# Altium project Modelo levitador magnético.PrjPcb
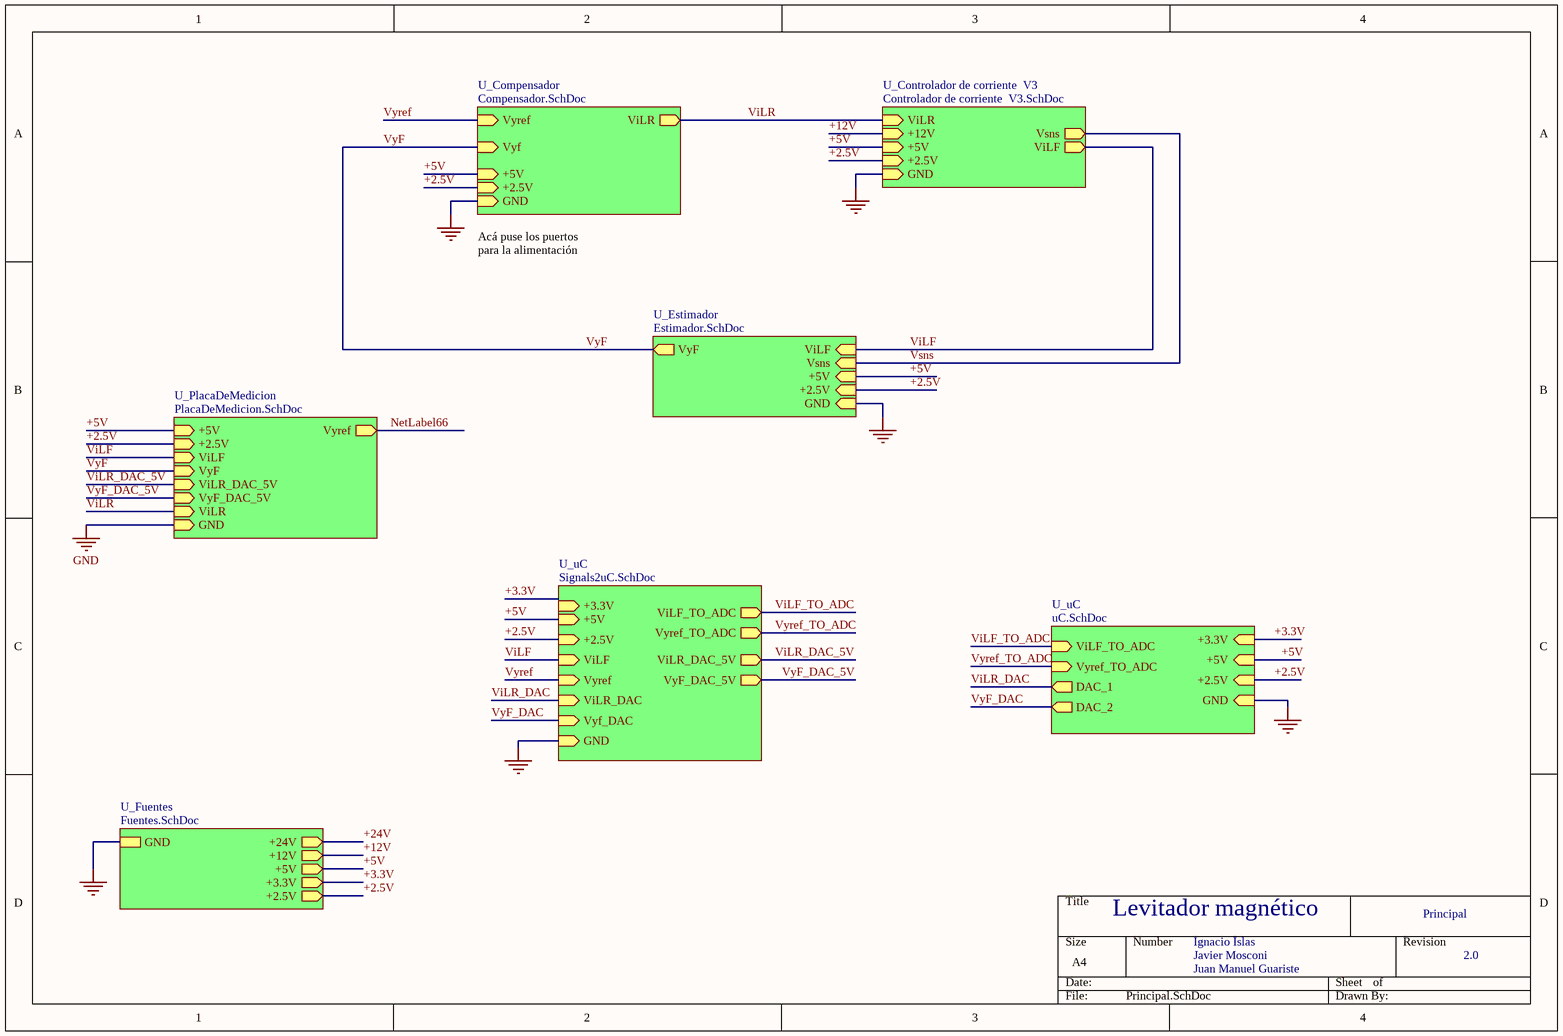
[diagram p0: Principal.SchDoc]
8 sheets, 222 parts. Net scope: hierarchical (ports join the sheet entries above them; power ports are global).
Sheets:
  Principal.SchDoc
    U_Controlador de corriente  V3 = Controlador de corriente  V3.SchDoc
    U_Fuentes = Fuentes.SchDoc
    U_Compensador = Compensador.SchDoc
    U_Estimador = Estimador.SchDoc
    U_uC = Signals2uC.SchDoc
    U_uC = uC.SchDoc
    U_PlacaDeMedicion = PlacaDeMedicion.SchDoc

## Sheet Principal.SchDoc: Levitador magnético
size A4; Date: 27/10/2020

### Sub-sheets
U_Compensador = Compensador.SchDoc: Vyf (in), ViLR (out), Vyref (in), +5V (in), +2.5V (in), GND (in)
U_Controlador de corriente  V3 = Controlador de corriente  V3.SchDoc: ViLR (in), ViLF (out), Vsns (out), +2.5V (in), +5V (in), GND (in), +12V (in)
U_Estimador = Estimador.SchDoc: ViLF (in), Vsns (in), +5V (in), +2.5V (in), GND (in), VyF (out)
U_Fuentes = Fuentes.SchDoc: +12V (out), +5V (out), +2.5V (out), +24V (out), GND, +3.3V (out)
U_PlacaDeMedicion = PlacaDeMedicion.SchDoc: Vyref (out), +5V (in), +2.5V (in), ViLF (in), VyF (in), ViLR_DAC_5V (in), VyF_DAC_5V (in), GND (in), ViLR (in)
U_uC = Signals2uC.SchDoc: ViLF (in), +3.3V (in), +5V (in), +2.5V (in), GND (in), Vyref (in), ViLF_TO_ADC (out), Vyref_TO_ADC (out), ViLR_DAC (in), Vyf_DAC (in), ViLR_DAC_5V (out), VyF_DAC_5V (out)
U_uC = uC.SchDoc: +3.3V (in), +5V (in), +2.5V (in), GND (in), ViLF_TO_ADC (in), Vyref_TO_ADC (in), DAC_1 (out), DAC_2 (out)

### Nets
+2.5V: sheet U_Controlador de corriente  V3/+2.5V, sheet U_Fuentes/+2.5V, sheet U_Compensador/+2.5V, sheet U_Estimador/+2.5V, sheet U_uC/+2.5V, sheet U_uC/+2.5V, sheet U_PlacaDeMedicion/+2.5V
+3.3V: sheet U_Fuentes/+3.3V, sheet U_uC/+3.3V, sheet U_uC/+3.3V
+5V: sheet U_Controlador de corriente  V3/+5V, sheet U_Fuentes/+5V, sheet U_Compensador/+5V, sheet U_Estimador/+5V, sheet U_uC/+5V, sheet U_uC/+5V, sheet U_PlacaDeMedicion/+5V
+12V: sheet U_Controlador de corriente  V3/+12V, sheet U_Fuentes/+12V
GND: sheet U_Controlador de corriente  V3/GND, sheet U_Fuentes/GND, sheet U_Compensador/GND, sheet U_Estimador/GND, sheet U_uC/GND, sheet U_uC/GND, sheet U_PlacaDeMedicion/GND  [project net VSSA]
ViLF: sheet U_Controlador de corriente  V3/ViLF, sheet U_Estimador/ViLF, sheet U_uC/ViLF, sheet U_PlacaDeMedicion/ViLF
ViLF_TO_ADC: sheet U_uC/ViLF_TO_ADC, sheet U_uC/ViLF_TO_ADC
ViLR: sheet U_Controlador de corriente  V3/ViLR, sheet U_Compensador/ViLR, sheet U_PlacaDeMedicion/ViLR
ViLR_DAC: sheet U_uC/ViLR_DAC, sheet U_uC/DAC_1
ViLR_DAC_5V: sheet U_uC/ViLR_DAC_5V, sheet U_PlacaDeMedicion/ViLR_DAC_5V
Vsns: sheet U_Controlador de corriente  V3/Vsns, sheet U_Estimador/Vsns
VyF: sheet U_Compensador/Vyf, sheet U_Estimador/VyF, sheet U_PlacaDeMedicion/VyF
VyF_DAC: sheet U_uC/Vyf_DAC, sheet U_uC/DAC_2
VyF_DAC_5V: sheet U_uC/VyF_DAC_5V, sheet U_PlacaDeMedicion/VyF_DAC_5V
Vyref: sheet U_Compensador/Vyref, sheet U_uC/Vyref
Vyref_TO_ADC: sheet U_uC/Vyref_TO_ADC, sheet U_uC/Vyref_TO_ADC

### Notes on the sheet
- Acá puse los puertos para la alimentación
- Principal
- Ignacio Islas
- Javier Mosconi
- Juan Manuel Guariste
- 2.0

## Sheet Controlador de corriente  V3.SchDoc: Levitador magnético
size A4
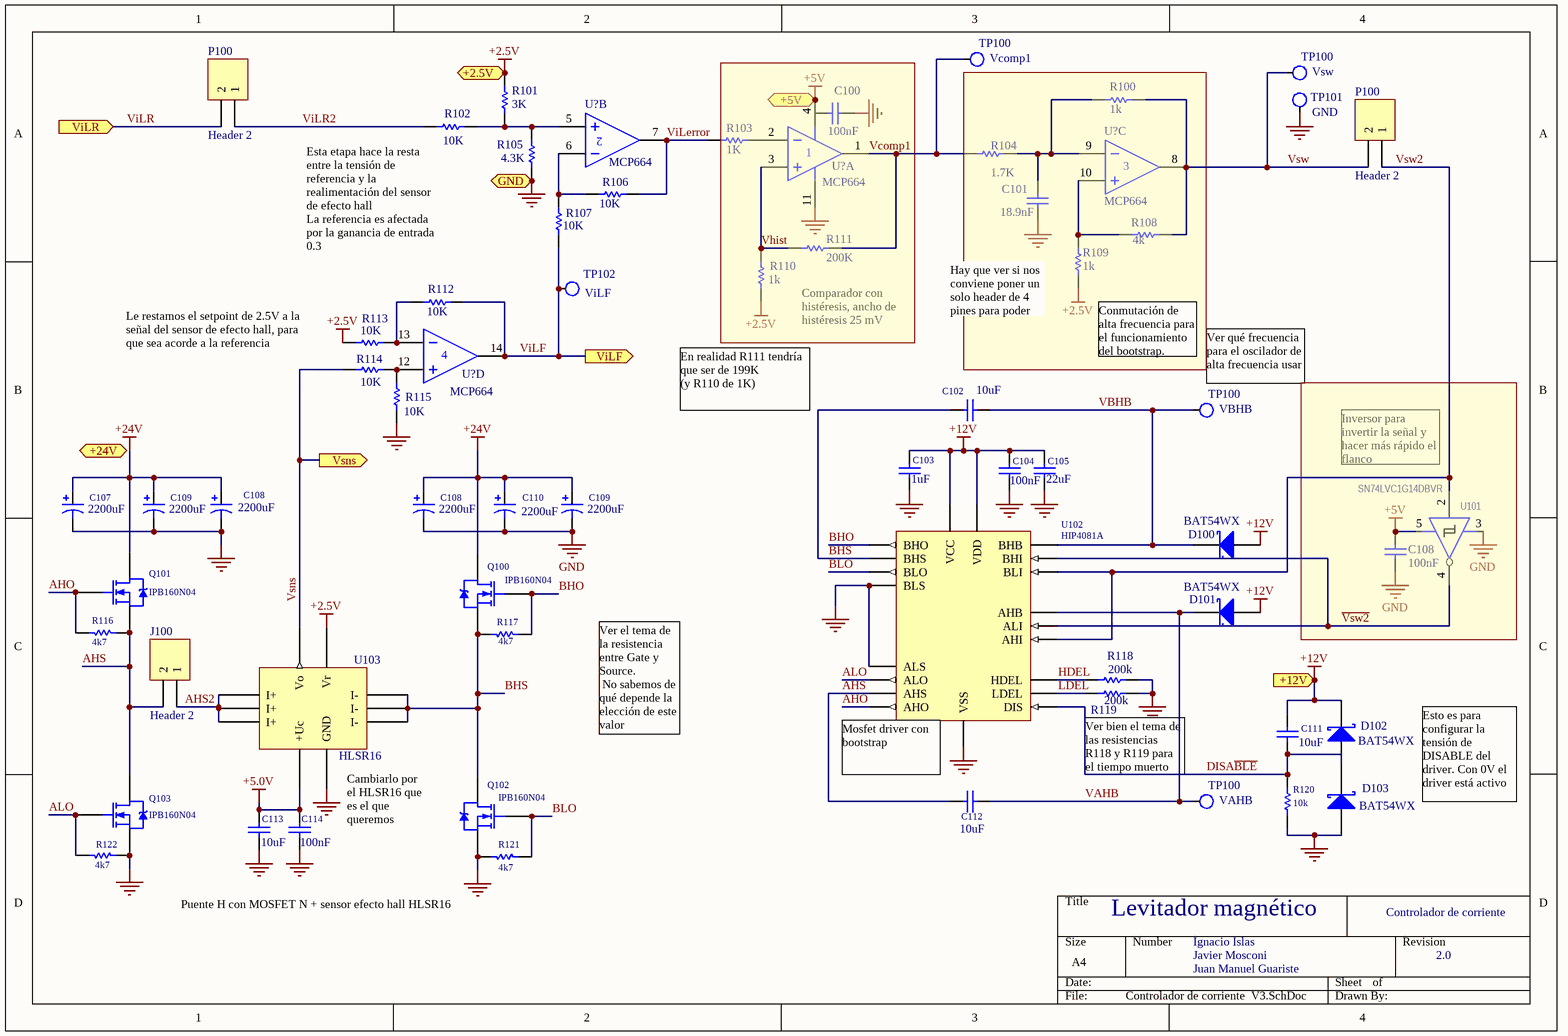
[diagram p1: Controlador de corriente  V3.SchDoc]

### Parts
(Parts that share a designator on the sheet are numbered #1, #2 ... from top to bottom, then left to right.)
C100  value 100nF  [C1206]  (hidden comment: Cap)
C101  value 18.9nF  [C1206]  (hidden comment: Cap)
C102  10uF  [C1206]
C103  1uF  [C1206]
C104  100nF  [C1206]
C105  22uF  [C1206]
C107  value 2200uF  [ALU CASE P]  (hidden comment: Cap Pol1)
C108#1  value 2200uF  [ALU CASE P]  (hidden comment: Cap Pol1)
C108#2  value 2200uF  [ALU CASE P]  (hidden comment: Cap Pol1)
C108#3  value 100nF  [C1206]  (hidden comment: Cap)
C109#1  value 2200uF  [ALU CASE P]  (hidden comment: Cap Pol1)
C109#2  value 2200uF  [ALU CASE P]  (hidden comment: Cap Pol1)
C110  value 2200uF  [ALU CASE P]  (hidden comment: Cap Pol1)
C111  10uF  [C1206]
C112  10uF  [C1206]
C113  10uF  [C1206]
C114  100nF  [C1206]
D100  BAT54WX  [SOD523]
D101  BAT54WX  [SOD523]
D102  BAT54WX  [SOD523]
D103  BAT54WX  [SOD523]
J100  Header 2  [SMKDS5-2-9.5]
P100#1  Header 2  [HDR1X2]
P100#2  Header 2  [HDR1X2]
Q100  IPB160N04  [TO263-7S]
Q101  IPB160N04  [TO263-7S]
Q102  IPB160N04  [TO263-7S]
Q103  IPB160N04  [TO263-7S]
R100  value 1k  [R 1206L]  (hidden comment: Res1)
R101  value 3K  [R 1206L]  (hidden comment: Res1)
R102  value 10K  [R 1206L]  (hidden comment: Res1)
R103  value 1K  [R 1206L]  (hidden comment: Res1)
R104  value 1.7K  [R 1206L]  (hidden comment: Res1)
R105  value 4.3K  [R 1206L]  (hidden comment: Res1)
R106  value 10K  [R 1206L]  (hidden comment: Res1)
R107  value 10K  [R 1206L]  (hidden comment: Res1)
R108  value 4k  [R 1206L]  (hidden comment: Res1)
R109  value 1k  [R 1206L]  (hidden comment: Res1)
R110  value 1k  [R 1206L]  (hidden comment: Res1)
R111  value 200K  [R 1206L]  (hidden comment: Res1)
R112  value 10K  [R 1206L]  (hidden comment: Res1)
R113  value 10K  [R 1206L]  (hidden comment: Res1)
R114  value 10K  [R 1206L]  (hidden comment: Res1)
R115  value 10K  [R 1206L]  (hidden comment: Res1)
R116  4k7  [R 1206L]
R117  4k7  [R 1206L]
R118  value 200k  [R 1206L]  (hidden comment: Res1)
R119  value 200k  [R 1206L]  (hidden comment: Res1)
R120  10k  [R 1206L]
R121  4k7  [R 1206L]
R122  4k7  [R 1206L]
TP100#1  Vcomp1  [TestPoint Keystone 5000 Silver-Red]
TP100#2  Vsw  [TestPoint Keystone 5000 Silver-Red]
TP100#3  VBHB  [TestPoint Keystone 5000 Silver-Red]
TP100#4  VAHB  [TestPoint Keystone 5000 Silver-Red]
TP101  GND  [TestPoint Keystone 5000 Silver-Red]
TP102  ViLF  [TestPoint Keystone 5000 Silver-Red]
U101  SN74LVC1G14DBVR  [SOT23-5]
U102  HIP4081A  [SOIC20]
U103  HLSR16  [HSLR-P]
U?#1  MCP664  (part B of 4)
U?#2  MCP664  (part A of 4)
U?#3  MCP664  (part C of 4)
U?#4  MCP664  (part D of 4)

### Ports
+2.5V (in), +5V (in), +12V (in), +24V (in), GND (in), ViLF (out), ViLR (in), Vsns (out)

### Nets
+2.5V: R101.2 R109.1 R110.1 R113.1 U103.1(Vr) ; port +2.5V
+5V: C108#3.1 C113.2 C114.2 U101.5(V+) U103.4(+Uc) U?#2.4(V+) ; port +5V  [also labelled +5.0V]
+12V: C103.2 C104.2 C105.2 C111.1 D100.1(A) D101.1(A) D102.2(K) U102.15(VCC) U102.16(VDD) ; port +12V
+24V: C107.1 C108#1.1 C108#2.1 C109#1.1 C109#2.1 C110.1 Q100.4(D) Q101.4(D)
GND: C100.2 C101.1 C103.1 C104.1 C105.1 C107.2 C108#1.2 C108#2.2 C108#3.2 C109#1.2 C109#2.2 C110.2 C113.1 C114.1 D103.1(A) Q102.2(S) Q102.3(S) Q102.5(S) Q102.6(S) Q102.7(S) Q103.2(S) Q103.3(S) Q103.5(S) Q103.6(S) Q103.7(S) R105.2 R115.1 R118.2 R119.2 R120.2 R121.2 R122.1 TP101.1 U101.3(V-) U102.4(VSS) U102.14(ALS) U102.17(BLS) U103.3(GND) U?#2.11(V-) ; port GND  [project net VSSA]
AHO: Q101.1(G) R116.2 U102.11(AHO)
AHS: C112.1 J100.2 Q101.2(S) Q101.3(S) Q101.5(S) Q101.6(S) Q101.7(S) Q103.4(D) R116.1 U102.12(AHS)
AHS2: J100.1 U103.8(I+) U103.9(I+) U103.10(I+)
ALO: Q103.1(G) R122.2 U102.13(ALO)
BHO: Q100.1(G) R117.1 U102.20(BHO)
BHS: C102.2 Q100.2(S) Q100.3(S) Q100.5(S) Q100.6(S) Q100.7(S) Q102.4(D) R117.2 U102.19(BHS) U103.5(I-) U103.6(I-) U103.7(I-)
BLO: Q102.1(G) R121.1 U102.18(BLO)
DISA~{BLE}: C111.2 R120.1 U102.3(DIS)
HDEL: R118.1 U102.8(HDEL)
LDEL: R119.1 U102.9(LDEL)
~{Vsw2}: U101.4(Y) U102.2(BHI) U102.6(ALI)
VAHB: C112.2 D101.2(K) TP100#4.1 U102.10(AHB)
VBHB: C102.1 D100.2(K) TP100#3.1 U102.1(BHB)
Vcomp1: R104.1 R111.2 TP100#1.1 U?#2.1(OUT)
Vhist: R110.2 R111.1 U?#2.3(IN+)
ViLerror: R103.1 R106.2 U?#1.7(OUT)
ViLF: R107.1 R112.2 TP102.1 U?#4.14(OUT) ; port ViLF
ViLR: P100#1.2 ; port ViLR
ViLR2: P100#1.1 R102.1
Vsns: R114.1 U103.2(Vo) ; port Vsns
Vsw: P100#2.2 R100.2 R108.2 TP100#2.1 U?#3.8(OUT)
Vsw2: P100#2.1 U101.2(A) U102.5(BLI) U102.7(AHI)
NetC101_2: C101.2 R100.1 R104.2 U?#3.9(IN-)
NetD102_1: D102.1(A) D103.2(K)
NetR101_1: R101.1 R102.2 R105.1 U?#1.5(IN+)
NetR103_2: R103.2 U?#2.2(IN-)
NetR106_1: R106.1 R107.2 U?#1.6(IN-)
NetR108_1: R108.1 R109.2 U?#3.10(IN+)
NetR112_1: R112.1 R113.2 U?#4.13(IN-)
NetR114_2: R114.2 R115.2 U?#4.12(IN+)

Not connected (* = marked no-connect by the designer): C100 1

### Notes on the sheet
- (near R102) Esta etapa hace la resta entre la tensión de referencia y la realimentación del sensor de efecto hall
  La referencia es afectada por la ganancia de entrada 0.3
- Hay que ver si nos conviene poner un solo header de 4 pines para poder puentear el oscilador de alta frecuencia
- Le restamos el setpoint de 2.5V a la señal del sensor de efecto hall, para que sea acorde a la referencia
- Comparador con histéresis, ancho de histéresis 25 mV
- Conmutación de alta frecuencia para el funcionamiento del bootstrap.
  Frecuencia a determinar >= 20 kHz (ponele)
- (near TP100#3) Ver qué frecuencia para el oscilador de alta frecuencia usar
- En realidad R111 tendría que ser de 199K
  (y R110 de 1K)
- Inversor para invertir la señal y hacer más rápido el flanco
- Ver el tema de la resistencia entre Gate y Source.
  No sabemos de qué depende la elección de este valor
- (near U102) Mosfet driver con bootstrap
- Ver bien el tema de las resistencias R118 y R119 para el tiempo muerto
- Esto es para configurar la tensión de DISABLE del driver. Con 0V el driver está activo
- Puente H con MOSFET N + sensor efecto hall HLSR16
- (near U103) Cambiarlo por el HLSR16 que es el que queremos
- Controlador de corriente
- Ignacio Islas
- Javier Mosconi
- Juan Manuel Guariste
- 2.0

### Library data of the parts
C100 C101 C108#3 = Cap: Capacitor; Published: 8-Jun-2000; LatestRevisionDate: 17-Jul-2002; LatestRevisionNote: Re-released for DXP Platform.; PackageReference: RAD-0.3; Publisher: Altium Limited; PackageDescription: Radial Cap, Thru-Hole; 2 Leads; 0.3 in Pin Spacing
C102-C105 C111-C114 = C1206: Capacitor Chip 1206; Dielectric: NP0; Voltage: 50V; Published: 8-Jun-2000; LatestRevisionDate: 26/08/2013; LatestRevisionNote: IPC-7351 Footprint Added.; PackageReference: 1206; Publisher: Altium Limited; PackageDescription: Chip Capacitor; Supplier 1: Digi-Key
  C102 C111-C113: Value: 10uF
  C103: Value: 1uF
  C104 C114: Value: 100nF
  C105: Value: 22uF
C107 C108#1 C108#2 C109#1 C109#2 C110 = Cap Pol1: Polarized Capacitor (Radial); ESR: 0.028 ohm; Published: 8-Jun-2000; LatestRevisionDate: 17-Jul-2002; LatestRevisionNote: Re-released for DXP Platform.; PackageReference: RB7.6-15; Publisher: Altium Limited
D100-D103 = Diode 10TQ035: Schottky Rectifier; Note: Terminal 2 is the TAB and is electrically connected to the cathode; Published: 8-Jun-2000; LatestRevisionDate: 17-Jul-2002; LatestRevisionNote: Re-released for DXP Platform.; DatasheetDocument: PD-2.057B; PackageDocument: Feb-1998; PackageReference: TO-220AC; Publisher: Altium Limited; ComponentLink1Description: Manufacturer Link; ComponentLink1URL: http://www.irf.com/; ComponentLink2Description: Datasheet; ComponentLink2URL: http://www.irf.com/product-info/datasheets/data/10tq.pdf
J100 P100#1 P100#2 = Header 2: Header, 2-Pin; LatestRevisionDate: 17-Jul-2002; LatestRevisionNote: Re-released for DXP Platform.; Publisher: Altium Limited
Q100-Q103 = IRF630S: HEXFET N-Channel Power MOSFET; Published: 8-Jun-2000; LatestRevisionDate: 17-Jul-2002; LatestRevisionNote: Re-released for DXP Platform.; DatasheetVersion: PD-9.901; PackageReference: PG-TO263-7-3; Publisher: Altium Limited; PackageDescription: D2-PAK/TO-263-AB; 3 Leads (1 Cropped); Body 15.5 (inc. leads) x 10.5 mm (LxW max); ComponentLink1Description: Manufacturer Link; ComponentLink1URL: http://www.irf.com/; ComponentLink2Description: Datasheet; ComponentLink2URL: http://www.irf.com/product-info/datasheets/data/irf630s.pdf
R100-R115 R118 R119 = Res1: Resistor; Published: 8-Jun-2000; LatestRevisionDate: 17-Jul-2002; LatestRevisionNote: Re-released for DXP Platform.; PackageReference: AXIAL-0.3; Publisher: Altium Limited; PackageDescription: Axial Device, Thru-Hole; 2 Leads; 0.3 in Pin Spacing
R116 R117 R120-R122 = R1206: Resistor Chip; 1/8W;; Published: 8-Jun-2000; LatestRevisionDate: 26/8/2013; PackageReference: 1206; Publisher: Altium Limited; PackageDescription: SMT Chip Resistor; Supplier 1: Digi-Key
  R116 R117 R121 R122: Value: 4k7
  R120: Value: 10k
TP100#1-TP100#4 TP101 TP102 = Tespoint: Test point
U101 = SN74LVC1G14DBVR: Schmitt-Trigger Inverter; Published: 8-Jun-2000; LatestRevisionDate: 13-Apr-2006; LatestRevisionNote: IPC-7351 Footprint Added.; DatasheetVersion: Jul-1998; PackageVersion: Jan-1998; PackageReference: D014; Publisher: Altium Limited; PackageDescription: 14-Pin Small Outline Integrated Circuit 1.27 mm Pitch; Code_IPC: SOIC127P600-14; ComponentLink1Description: Manufacturer Link; ComponentLink1URL: http://www.ti.com/; ComponentLink2Description: Datasheet; ComponentLink2URL: http://www-s.ti.com/sc/ds/sn74ahc14.pdf; ComponentLink3Description: Packaging Specification; ComponentLink3URL: http://focus.ti.com/lit/ml/mpds177/mpds177.pdf
U102 = HIP4081A: INTERSIL, 80V, 2.5A peak, High Frequency Full Bridge FET Driver
U103 = HSLR32: Hall Effect Current Sensor
U?#1-U?#4 = MCP664: Datasheet: https://ar.mouser.com/datasheet/2/268/22194B-77503.pdf

## Sheet Fuentes.SchDoc
size A4
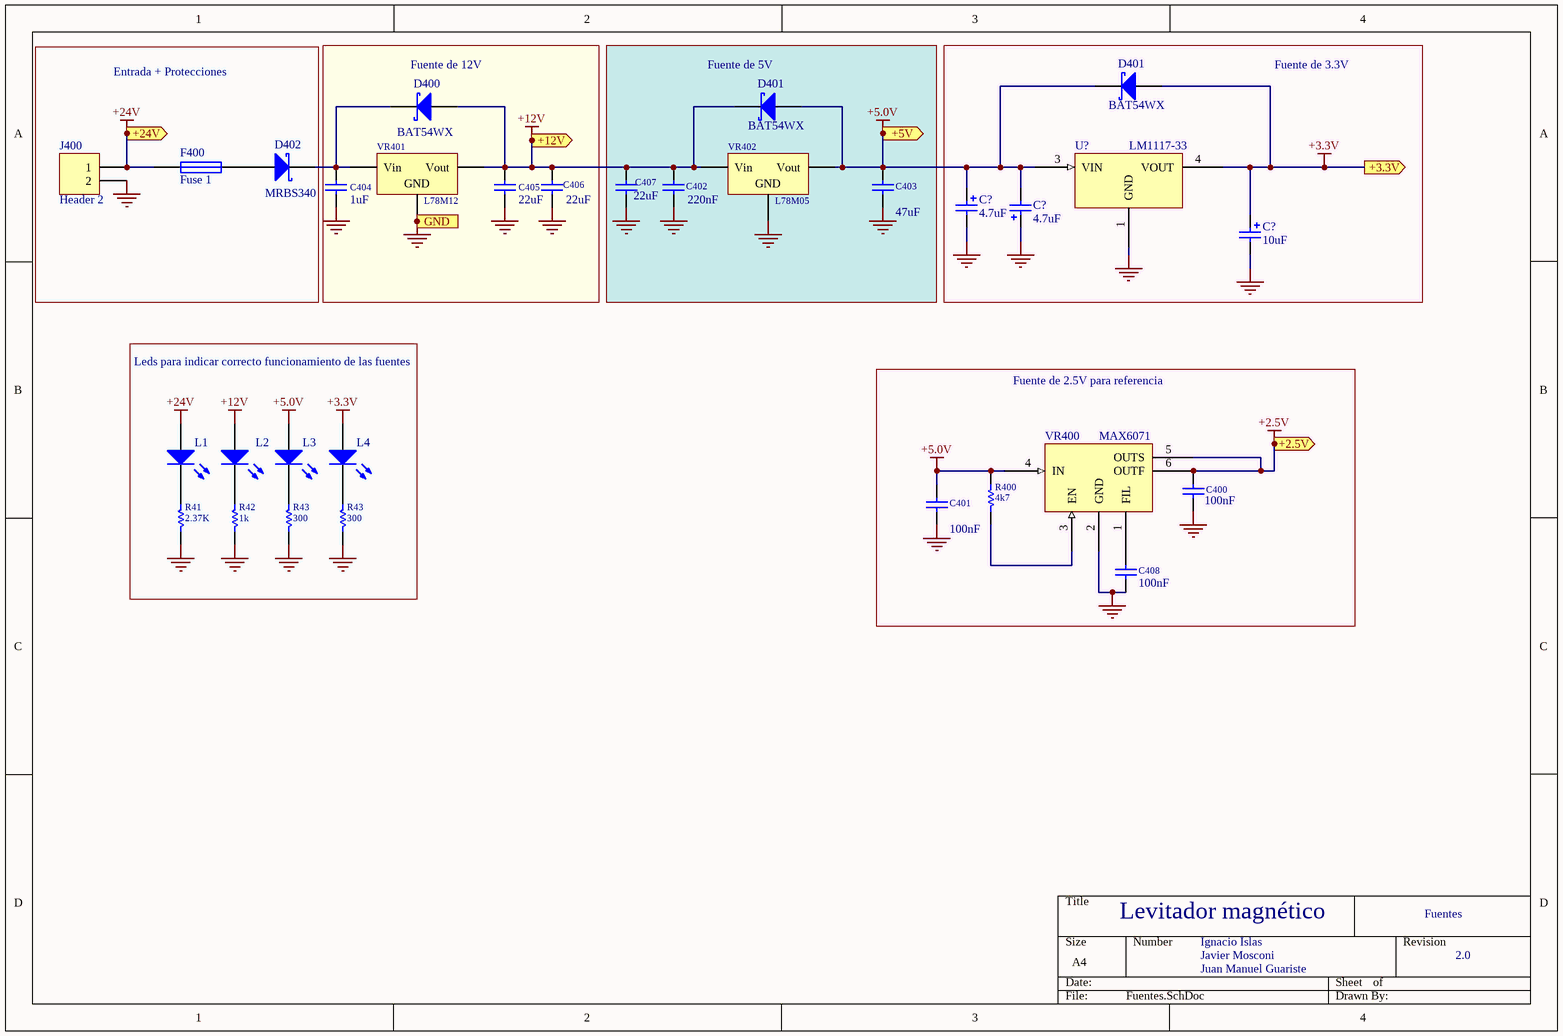
[diagram p2: Fuentes.SchDoc]

### Parts
(Parts that share a designator on the sheet are numbered #1, #2 ... from top to bottom, then left to right.)
C400  100nF  [C1206]
C401  100nF  [C1206]
C402  220nF  [C1206]
C403  47uF  [C1206]
C404  1uF  [C1206]
C405  22uF  [C1206]
C406  22uF  [C1206]
C407  22uF  [C1206]
C408  100nF  [C1206]
C?#1  value 4.7uF  [0805C2]  (hidden comment: Cap Pol2)
C?#2  value 4.7uF  [0805C2]  (hidden comment: Cap Pol2)
C?#3  value 10uF  [0805C2]  (hidden comment: Cap Pol2)
D400  BAT54WX  [SOD523]
D401#1  BAT54WX  [SOD523]
D401#2  BAT54WX  [SOD523]
D402  MRBS340  [DO214AB]
F400  Fuse 1  [R1206]
J400  Header 2  [SMKDS5-2-9.5]
L1  LED1  [LED 1206 RED]  (value not drawn)
L2  LED1  [LED 1206 RED]  (value not drawn)
L3  LED1  [LED 1206 RED]  (value not drawn)
L4  LED1  [LED 1206 RED]  (value not drawn)
R41  2.37K  [R 1206L]
R42  1k  [R 1206L]
R43#1  300  [R 1206L]
R43#2  300  [R 1206L]
R400  4k7  [R 1206L]
U?#5  LM1117-33  [SOT223-4M]
VR400  MAX6071  [SOT23-6]
VR401  L78M12  [TO252-AA]
VR402  L78M05  [TO252-AA]

### Blocks framed on the sheet
Entrada + Protecciones: D402 F400 J400
Fuente de 12V: C404-C406 D400 VR401
Fuente de 5V: C402 C403 C407 D401#2 VR402
Fuente de 3.3V: C?#1-C?#3 D401#1 U?#5
Leds para indicar correcto funcionamiento de las fuentes: L1-L4 R41 R42 R43#1 R43#2
Fuente de 2.5V para referencia: C400 C401 C408 R400 VR400

### Ports
+2.5V (out), +3.3V (out), +5V (out), +12V (out), +24V (out), GND

### Nets
+2.5V: C400.2 VR400.5(OUTS) VR400.6(OUTF) ; port +2.5V
+3.3V: C?#3.1 D401#1.1(A) L4.1(A) U?#5.4(VOUT) ; port +3.3V
+5.0V: C401.2 C403.2 C?#1.1 C?#2.2 D401#1.2(K) D401#2.1(A) L3.1(A) R400.2 U?#5.3(VIN) VR400.4(IN) VR402.3(Vout) ; port +5V  [project net +5V]
+12V: C402.2 C405.2 C406.2 C407.2 D400.1(A) D401#2.2(K) L2.1(A) VR401.3(Vout) VR402.1(Vin) ; port +12V
+24V: F400.1 J400.1 L1.1(A) ; port +24V
GND: C400.1 C401.1 C402.1 C403.1 C404.1 C405.1 C406.1 C407.1 C408.1 C?#1.2 C?#2.1 C?#3.2 J400.2 R41.1 R42.2 R43#1.1 R43#2.1 U?#5.1(GND) VR400.2(GND) VR401.4(GND) VR402.4(GND) ; port GND  [project net VSSA]
NetC404_2: C404.2 D400.2(K) D402.2(K) VR401.1(Vin)
NetC408_2: C408.2 VR400.1(FIL)
NetD402_1: D402.1(A) F400.2
NetL1_2: L1.2(K) R41.2
NetL2_2: L2.2(K) R42.1
NetL3_2: L3.2(K) R43#1.2
NetL4_2: L4.2(K) R43#2.2
NetR400_1: R400.1 VR400.3(EN)

### Notes on the sheet
- Levitador magnético
- Fuentes
- Ignacio Islas
- Javier Mosconi
- Juan Manuel Guariste
- 2.0

### Library data of the parts
C400 C401 C408 = C1206: as C102 on sheet Controlador de corriente  V3; Published: 8-Jun-2000; LatestRevisionDate: 26/08/2013; LatestRevisionNote: IPC-7351 Footprint Added.; PackageReference: 1206; Publisher: Altium Limited; PackageDescription: Chip Capacitor; Supplier 1: Digi-Key; Value: 100nF
C402 C404 = C1206: Capacitor Chip 1206; Dielectric: NP0; Voltage: 35V; Published: 8-Jun-2000; LatestRevisionDate: 26/08/2013; LatestRevisionNote: IPC-7351 Footprint Added.; PackageReference: 1206; Publisher: Altium Limited; PackageDescription: Chip Capacitor; Supplier 1: Digi-Key
  C402: Value: 220nF
  C404: Value: 1uF
C403 = C1206: Capacitor Chip 1206; Dielectric: NP0; Voltage: 6.3V; Published: 8-Jun-2000; LatestRevisionDate: 26/08/2013; LatestRevisionNote: IPC-7351 Footprint Added.; PackageReference: 1206; Publisher: Altium Limited; PackageDescription: Chip Capacitor; Supplier 1: Digi-Key; Value: 47uF
C405-C407 = C1206: Capacitor Chip 1206; Dielectric: NP0; Voltage: 16V; Published: 8-Jun-2000; LatestRevisionDate: 26/08/2013; LatestRevisionNote: IPC-7351 Footprint Added.; PackageReference: 1206; Publisher: Altium Limited; PackageDescription: Chip Capacitor; Supplier 1: Digi-Key; Value: 22uF
C?#1-C?#3 = Cap Pol2: Polarized Capacitor (Axial); P/N: Generic; Published: 8-Jun-2000; LatestRevisionDate: 17-Jul-2002; LatestRevisionNote: Re-released for DXP Platform.; PackageReference: POLAR0.8; Publisher: Altium Limited; Package: 0603
D400 D401#1 D401#2 D402 = Diode 10TQ035: as D100 on sheet Controlador de corriente  V3; Published: 8-Jun-2000; LatestRevisionDate: 17-Jul-2002; LatestRevisionNote: Re-released for DXP Platform.; DatasheetDocument: PD-2.057B; PackageDocument: Feb-1998; PackageReference: TO-220AC; Publisher: Altium Limited; ComponentLink1Description: Manufacturer Link; ComponentLink1URL: http://www.irf.com/; ComponentLink2Description: Datasheet; ComponentLink2URL: http://www.irf.com/product-info/datasheets/data/10tq.pdf
F400 = Fuse 1: Fuse; Published: 8-Jun-2000; LatestRevisionDate: 17-Jul-2002; LatestRevisionNote: Re-released for DXP Platform.; PackageReference: PIN-W2/E2.8; Publisher: Altium Limited
J400 = Header 2: Header, 2-Pin; LatestRevisionDate: 17-Jul-2002; LatestRevisionNote: Re-released for DXP Platform.; Publisher: Altium Limited
L1-L4 = LED1: Typical RED GaAs LED; Published: 8-Jun-2000; LatestRevisionDate: 08-Jul-2005; LatestRevisionNote: Mech Layer 1 removed.; PackageReference: LED-1; Publisher: Altium Limited
R41 R42 R43#1 R43#2 R400 = R1206: Resistor Chip; 1/8W;; Published: 8-Jun-2000; LatestRevisionDate: 26/8/2013; PackageReference: 1206; Publisher: Altium Limited; PackageDescription: SMT Chip Resistor; Supplier 1: Digi-Key
  R41: Value: 2.37K
  R42: Value: 1k
  R43#1 R43#2: Value: 300
  R400: Value: 4k7
U?#5 = LM1117-XX: Value: LM1117-33
VR400 = MAX6070
VR401 VR402 = Volt Reg: Voltage Regulator; Published: 24-Mar-1999; LatestRevisionDate: 17-Jul-2002; LatestRevisionNote: Re-released for DXP Platform.; PackageReference: D2PAK; Publisher: Altium Limited; Code_JEDEC: SMD-220

## Sheet Compensador.SchDoc
size A4
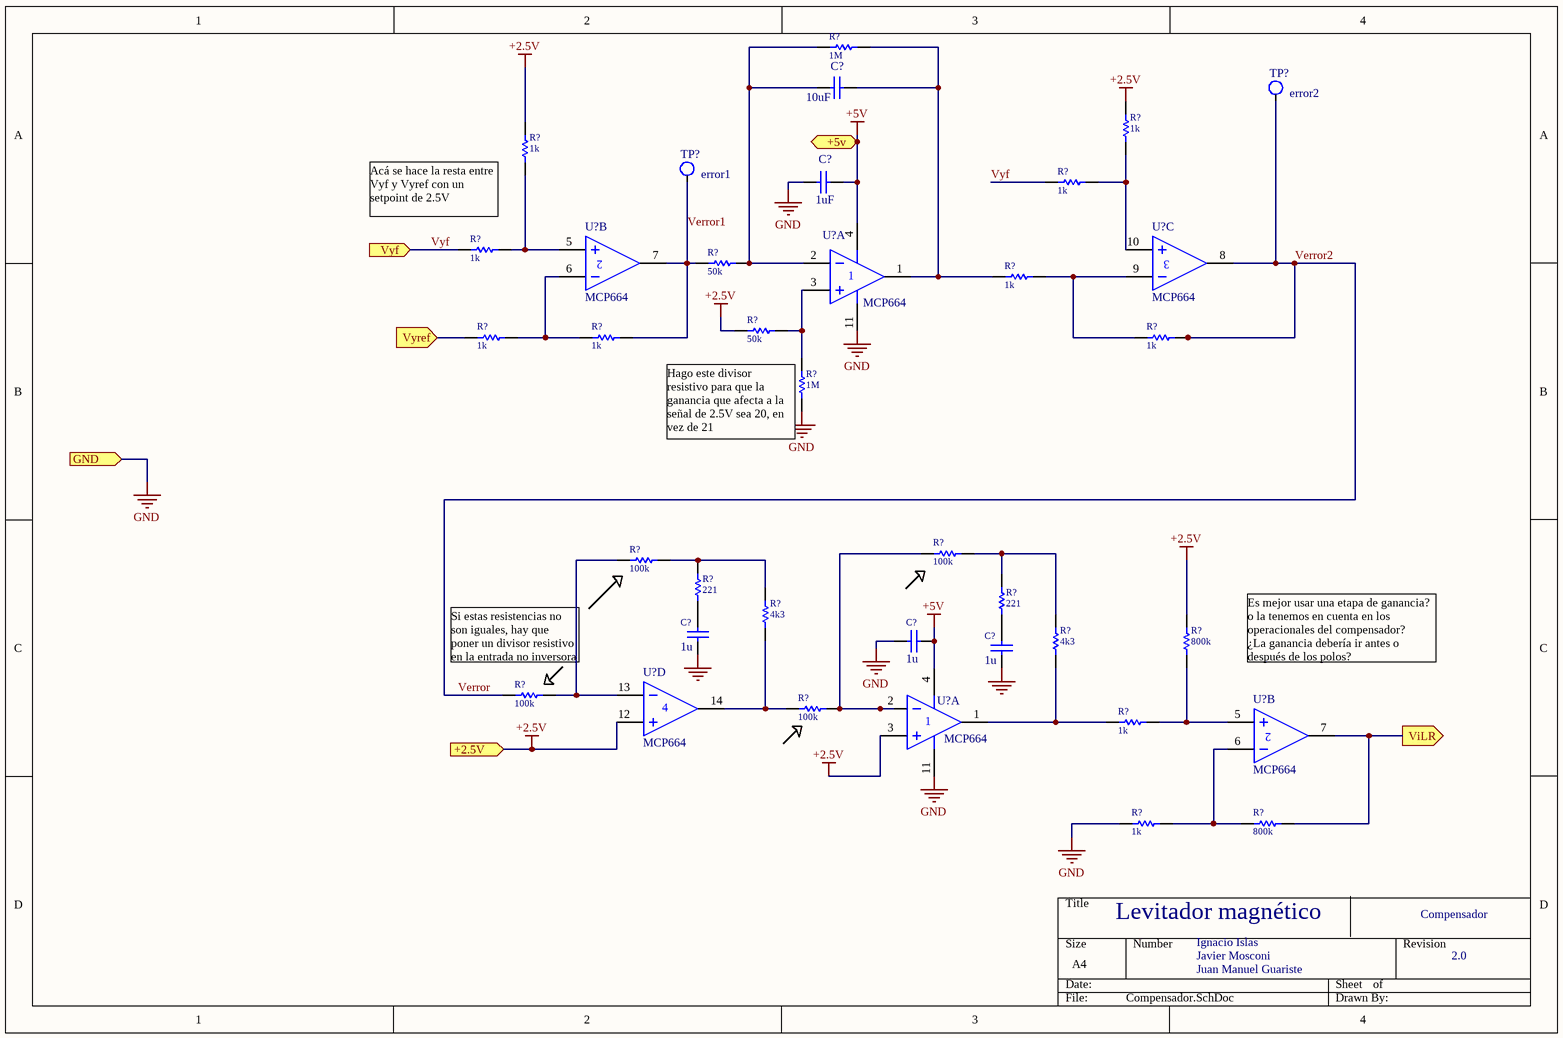
[diagram p3: Compensador.SchDoc]

### Parts
(Parts that share a designator on the sheet are numbered #1, #2 ... from top to bottom, then left to right.)
C?#4  value 10uF  [C1206]  (hidden comment: Cap)
C?#5  value 1uF  [C1206]  (hidden comment: Cap)
C?#6  1u  [C1206]
C?#7  1u  [C1206]
C?#8  1u  [C1206]
R?#1  1M  [R 1206L]
R?#2  1k  [R 1206L]
R?#3  1k  [R 1206L]
R?#4  1k  [R 1206L]
R?#5  1k  [R 1206L]
R?#6  50k  [R 1206L]
R?#7  1k  [R 1206L]
R?#8  50k  [R 1206L]
R?#9  1k  [R 1206L]
R?#10  1k  [R 1206L]
R?#11  1k  [R 1206L]
R?#12  1M  [R 1206L]
R?#13  100k  [R 1206L]
R?#14  100k  [R 1206L]
R?#15  221  [R 1206L]
R?#16  221  [R 1206L]
R?#17  4k3  [R 1206L]
R?#18  4k3  [R 1206L]
R?#19  800k  [R 1206L]
R?#20  100k  [R 1206L]
R?#21  100k  [R 1206L]
R?#22  1k  [R 1206L]
R?#23  1k  [R 1206L]
R?#24  800k  [R 1206L]
TP?#1  error2  [TestPoint Keystone 5000 Silver-Red]
TP?#2  error1  [TestPoint Keystone 5000 Silver-Red]
U?#6  MCP664  [SOIC14]  (part B of 4)
U?#7  MCP664  [SOIC14]  (part C of 4)
U?#8  MCP664  [SOIC14]  (part A of 4)
U?#9  MCP664  [SOIC14]  (part D of 4)
U?#10  MCP664  [SOIC14]  (part A of 4)
U?#11  MCP664  [SOIC14]  (part B of 4)

### Ports
+2.5V (in), +5v (in), GND (in), ViLR (out), Vyf (in), Vyref (in)

### Nets
+2.5V: R?#2.2 R?#3.2 R?#8.1 R?#19.2 U?#9.12(IN+) U?#10.3(IN+) ; port +2.5V
+5V: C?#5.2 C?#7.1 U?#8.4(V+) U?#10.4(V+) ; port +5v
GND: C?#5.1 C?#6.1 C?#7.2 C?#8.1 R?#12.1 R?#23.1 U?#8.11(V-) U?#10.11(V-) ; port GND  [project net VSSA]
Verror: R?#11.2 R?#20.1 TP?#1.1 U?#7.8(OUT)  [also labelled Verror2]
Verror1: R?#6.1 R?#10.2 TP?#2.1 U?#6.7(OUT)
ViLR: R?#24.2 U?#11.7(OUT) ; port ViLR
VyF: R?#4.1 R?#5.1 ; port Vyf
Vyref: R?#9.1 ; port Vyref
NetC?#4_1: C?#4.1 R?#1.1 R?#6.2 U?#8.2(IN-)
NetC?#4_2: C?#4.2 R?#1.2 R?#7.1 U?#8.1(OUT)
NetC?#6_2: C?#6.2 R?#15.1
NetC?#8_2: C?#8.2 R?#16.1
NetR?#2_1: R?#2.1 R?#4.2 U?#7.10(IN+)
NetR?#3_1: R?#3.1 R?#5.2 U?#6.5(IN+)
NetR?#7_2: R?#7.2 R?#11.1 U?#7.9(IN-)
NetR?#8_2: R?#8.2 R?#12.2 U?#8.3(IN+)
NetR?#9_2: R?#9.2 R?#10.1 U?#6.6(IN-)
NetR?#13_1: R?#13.1 R?#21.2 U?#10.2(IN-)
NetR?#13_2: R?#13.2 R?#16.2 R?#18.1
NetR?#14_1: R?#14.1 R?#20.2 U?#9.13(IN-)
NetR?#14_2: R?#14.2 R?#15.2 R?#17.1
NetR?#17_2: R?#17.2 R?#21.1 U?#9.14(OUT)
NetR?#18_2: R?#18.2 R?#22.1 U?#10.1(OUT)
NetR?#19_1: R?#19.1 R?#22.2 U?#11.5(IN+)
NetR?#23_2: R?#23.2 R?#24.1 U?#11.6(IN-)

### Notes on the sheet
- (near R?#3) Acá se hace la resta entre Vyf y Vyref con un setpoint de 2.5V
- (near R?#12) Hago este divisor resistivo para que la ganancia que afecta a la señal de 2.5V sea 20, en vez de 21
- (near R?#20) Si estas resistencias no son iguales, hay que poner un divisor resistivo en la entrada no inversora
- Es mejor usar una etapa de ganancia? o la tenemos en cuenta en los operacionales del compensador?
  ¿La ganancia debería ir antes o después de los polos?
- Levitador magnético
- Compensador
- Ignacio Islas
- Javier Mosconi
- Juan Manuel Guariste
- 2.0

### Library data of the parts
C?#4 C?#5 = Cap: Capacitor; Published: 8-Jun-2000; LatestRevisionDate: 17-Jul-2002; LatestRevisionNote: Re-released for DXP Platform.; PackageReference: RAD-0.3; Publisher: Altium Limited; PackageDescription: Radial Cap, Thru-Hole; 2 Leads; 0.3 in Pin Spacing
C?#6-C?#8 = C1206: as C102 on sheet Controlador de corriente  V3; Published: 8-Jun-2000; LatestRevisionDate: 26/08/2013; LatestRevisionNote: IPC-7351 Footprint Added.; PackageReference: 1206; Publisher: Altium Limited; PackageDescription: Chip Capacitor; Supplier 1: Digi-Key; Value: 1u
R?#1-R?#24 = R1206: Resistor Chip; 1/8W;; Published: 8-Jun-2000; LatestRevisionDate: 26/8/2013; PackageReference: 1206; Publisher: Altium Limited; PackageDescription: SMT Chip Resistor; Supplier 1: Digi-Key
  R?#1 R?#12: Value: 1M
  R?#2-R?#5 R?#7 R?#9-R?#11 R?#22 R?#23: Value: 1k
  R?#6 R?#8: Value: 50k
  R?#13 R?#14 R?#20 R?#21: Value: 100k
  R?#15 R?#16: Value: 221
  R?#17 R?#18: Value: 4k3
  R?#19 R?#24: Value: 800k
TP?#1 TP?#2 = Tespoint: Test point
U?#6-U?#11 = MCP664: Datasheet: https://ar.mouser.com/datasheet/2/268/22194B-77503.pdf

## Sheet Estimador.SchDoc
size A4
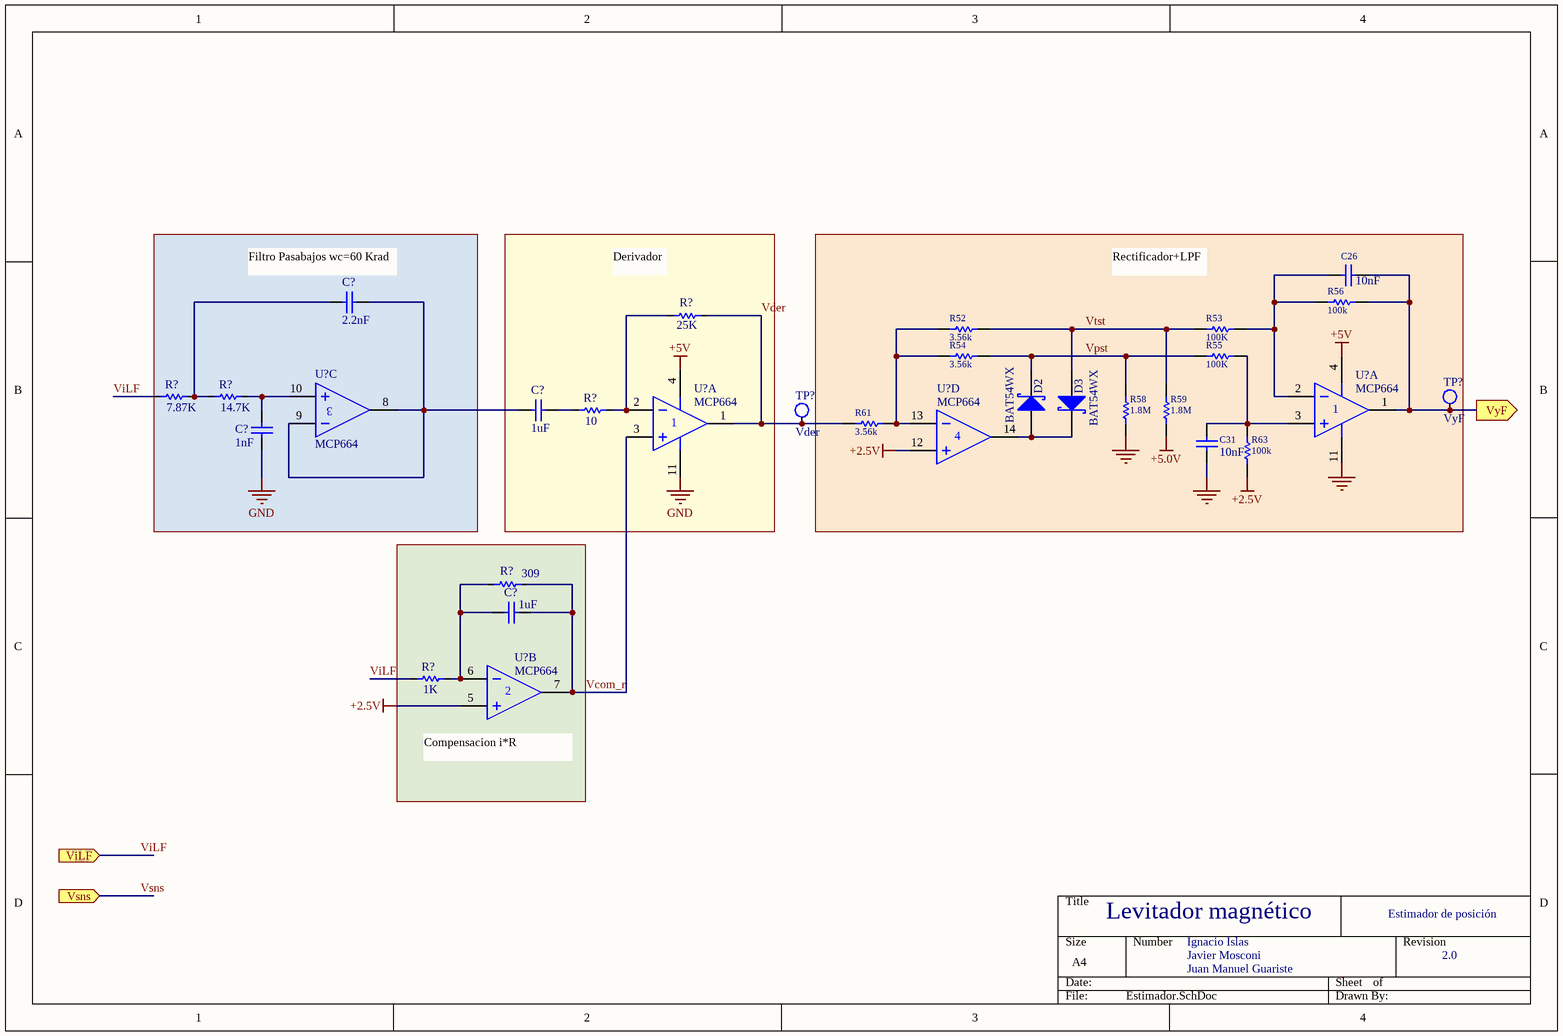
[diagram p4: Estimador.SchDoc]

### Parts
(Parts that share a designator on the sheet are numbered #1, #2 ... from top to bottom, then left to right.)
C26  10nF  [C1206]
C31  10nF  [C1206]
C?#9  value 2.2nF  [0603]  (hidden comment: Capacitor)
C?#10  value 1uF  [0603]  (hidden comment: Capacitor)
C?#11  value 1nF  [0603]  (hidden comment: Capacitor)
C?#12  value 1uF  [0603]  (hidden comment: Capacitor)
D2  BAT54WX  [SOD523]
D3  BAT54WX  [SOD523]
R52  3.56k  [R1206]
R53  100K  [R1206]
R54  3.56k  [R1206]
R55  100K  [R1206]
R56  100k  [R1206]
R58  1.8M  [R1206]
R59  1.8M  [R1206]
R61  3.56k  [R1206]
R63  100k  [R1206]
R?#25  value 25K  [0603]  (hidden comment: Resistencia)
R?#26  value 7.87K  [R 1206L]  (hidden comment: Resistencia)
R?#27  value 14.7K  [R 1206L]  (hidden comment: Resistencia)
R?#28  value 10  [0603]  (hidden comment: Resistencia)
R?#29  value 309  [0603]  (hidden comment: Resistencia)
R?#30  value 1K  [0603]  (hidden comment: Resistencia)
TP?#3  VyF  [TestPoint Keystone 5000 Silver-Red]
TP?#4  Vder  [TestPoint Keystone 5000 Silver-Red]
U?#12  MCP664  (part C of 4)
U?#13  MCP664  (part A of 4)
U?#14  MCP664  (part A of 4)
U?#15  MCP664  (part D of 4)
U?#16  MCP664  (part B of 4)

### Ports
ViLF (in), Vsns (in), VyF (out)

### Nets
+2.5V: R63.2 U?#15.12(IN+) U?#16.5(IN+)
+5V: R59.1 U?#13.4(V+) U?#14.4(V+)  [also labelled +5.0V]
GND: C31.1 C?#11.1 R58.1 U?#13.11(V-) U?#14.11(V-)  [project net VSSA]
Vcom_r: C?#12.2 R?#29.2 U?#14.3(IN+) U?#16.7(OUT)
Vder: R61.1 R?#25.2 TP?#4.1 U?#14.1(OUT)
ViLF: R?#26.1 R?#30.1 ; port ViLF
Vpst: D2.2(K) R54.2 R55.2 R58.2
Vtst: D3.1(A) R52.2 R53.2 R59.2
VyF: C26.1 R56.1 TP?#3.1 U?#13.1(OUT) ; port VyF
NetC26_2: C26.2 R53.1 R56.2 U?#13.2(IN-)
NetC31_2: C31.2 R55.1 R63.1 U?#13.3(IN+)
NetC?#9_1: C?#9.1 R?#26.2 R?#27.1
NetC?#9_2: C?#9.2 C?#10.1 U?#12.8(OUT) U?#12.9(IN-)
NetC?#10_2: C?#10.2 R?#28.1
NetC?#11_2: C?#11.2 R?#27.2 U?#12.10(IN+)
NetC?#12_1: C?#12.1 R?#29.1 R?#30.2 U?#16.6(IN-)
NetD2_1: D2.1(A) D3.2(K) U?#15.14(OUT)
NetR52_1: R52.1 R54.1 R61.2 U?#15.13(IN-)
NetR?#25_1: R?#25.1 R?#28.2 U?#14.2(IN-)

### Notes on the sheet
- (near C?#9) Filtro Pasabajos wc=60 Krad
- (near R?#25) Derivador
- Rectificador+LPF
- (near U?#16) Compensacion i*R
- Levitador magnético
- Estimador de posición
- Ignacio Islas
- Javier Mosconi
- Juan Manuel Guariste
- 2.0

### Library data of the parts
C26 C31 = C1206: as C102 on sheet Controlador de corriente  V3; Published: 8-Jun-2000; LatestRevisionDate: 26/08/2013; LatestRevisionNote: IPC-7351 Footprint Added.; PackageReference: 1206; Publisher: Altium Limited; PackageDescription: Chip Capacitor; Supplier 1: Digi-Key; Value: 10nF
C?#9-C?#12 = Capacitor: Manufacturer: Generic Components; Class: Passive; Published: 08/06/2000; Publisher: Altium Hobart Technology Centre; SubClass: Capacitor
D2 D3 = Diode 10TQ035: as D100 on sheet Controlador de corriente  V3; Published: 8-Jun-2000; LatestRevisionDate: 17-Jul-2002; LatestRevisionNote: Re-released for DXP Platform.; DatasheetDocument: PD-2.057B; PackageDocument: Feb-1998; PackageReference: TO-220AC; Publisher: Altium Limited; ComponentLink1Description: Manufacturer Link; ComponentLink1URL: http://www.irf.com/; ComponentLink2Description: Datasheet; ComponentLink2URL: http://www.irf.com/product-info/datasheets/data/10tq.pdf
R52-R56 R58 R59 R61 R63 = R1206: Resistor Chip; 1/8W;; Published: 8-Jun-2000; LatestRevisionDate: 26/8/2013; PackageReference: 1206; Publisher: Altium Limited; PackageDescription: SMT Chip Resistor; Supplier 1: Digi-Key
  R52 R54 R61: Value: 3.56k
  R53 R55: Value: 100K
  R56 R63: Value: 100k
  R58 R59: Value: 1.8M
R?#25-R?#30 = Resistencia: Manufacturer: Generic Components; Class I: Passive; Class II: Resistor; Published: 8-Jun-2000; Revision: July-2002: Re-released for DXP Platform.; Publisher: Altium Limited
TP?#3 TP?#4 = Tespoint: Test point; Link: https://www.digikey.com/en/products/detail/keystone-electronics/5000/255326
U?#12-U?#16 = MCP664: Datasheet: https://ar.mouser.com/datasheet/2/268/22194B-77503.pdf

## Sheet Signals2uC.SchDoc
size A4
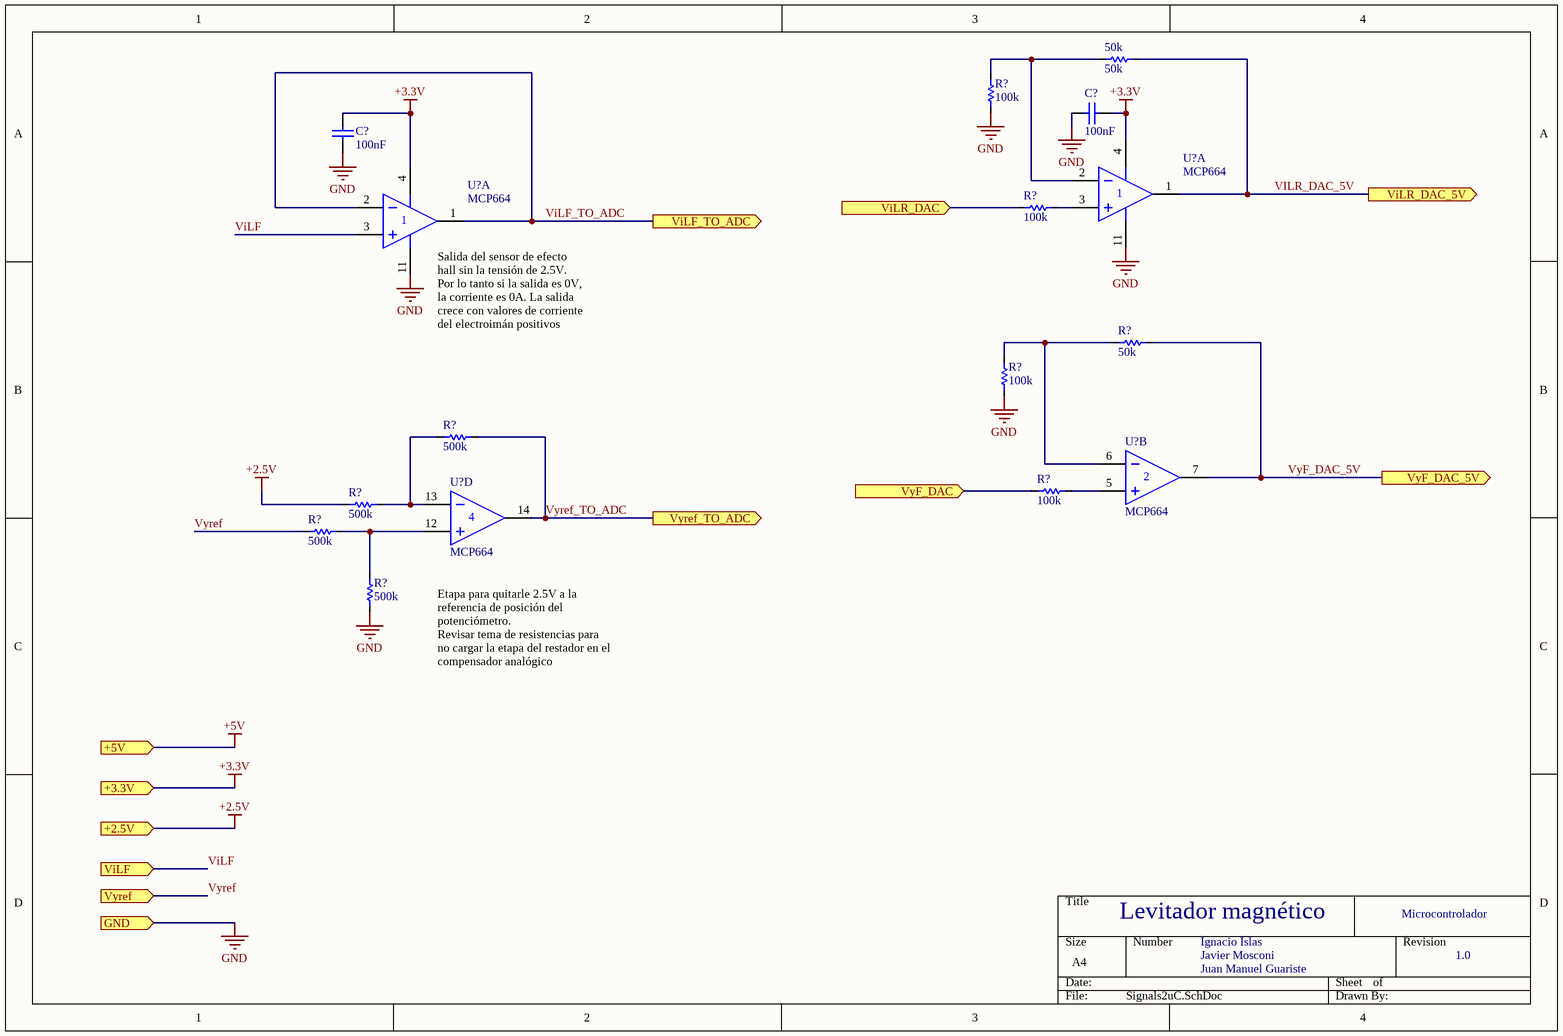
[diagram p5: Signals2uC.SchDoc]

### Parts
(Parts that share a designator on the sheet are numbered #1, #2 ... from top to bottom, then left to right.)
50k  value 50k  [R 1206L]  (hidden comment: Resistencia)
C?#13  value 100nF  [R2012-0805]  (hidden comment: Capacitor)
C?#14  value 100nF  [R2012-0805]  (hidden comment: Capacitor)
R?#31  value 100k  [R 1206L]  (hidden comment: Resistencia)
R?#32  value 100k  [R 1206L]  (hidden comment: Resistencia)
R?#33  value 50k  [R 1206L]  (hidden comment: Resistencia)
R?#34  value 100k  [R 1206L]  (hidden comment: Resistencia)
R?#35  value 500k  [R 1206L]  (hidden comment: Resistencia)
R?#36  value 100k  [R 1206L]  (hidden comment: Resistencia)
R?#37  value 500k  [R 1206L]  (hidden comment: Resistencia)
R?#38  value 500k  [R 1206L]  (hidden comment: Resistencia)
R?#39  value 500k  [R 1206L]  (hidden comment: Resistencia)
U?#17  MCP664  [SOIC14]  (part A of 4)
U?#18  MCP664  [SOIC14]  (part A of 4)
U?#19  MCP664  [SOIC14]  (part B of 4)
U?#20  MCP664  [SOIC14]  (part D of 4)

### Ports
+2.5V (in), +3.3V (in), +5V (in), GND (in), ViLF (in), ViLF_TO_ADC (out), ViLR_DAC (in), ViLR_DAC_5V (out), VyF_DAC (in), VyF_DAC_5V (out), Vyref (in), Vyref_TO_ADC (out)

### Nets
+2.5V: R?#37.2 ; port +2.5V
+3.3V: C?#13.2 C?#14.1 U?#17.4(V+) U?#18.4(V+) ; port +3.3V
GND: C?#13.1 C?#14.2 R?#31.1 R?#34.1 R?#39.1 U?#17.11(V-) U?#18.11(V-) ; port GND  [project net VSSA]
ViLF: U?#18.3(IN+) ; port ViLF
ViLF_TO_ADC: U?#18.1(OUT) U?#18.2(IN-) ; port ViLF_TO_ADC
ViLR_DAC: R?#32.1 ; port ViLR_DAC
ViLR_DAC_5V: 50k.2 U?#17.1(OUT) ; port ViLR_DAC_5V
VyF_DAC: R?#36.1 ; port VyF_DAC
VyF_DAC_5V: R?#33.2 U?#19.7(OUT) ; port VyF_DAC_5V
Vyref: R?#38.2 ; port Vyref
Vyref_TO_ADC: R?#35.2 U?#20.14(OUT) ; port Vyref_TO_ADC
Net50k_1: 50k.1 R?#31.2 U?#17.2(IN-)
NetR?#32_2: R?#32.2 U?#17.3(IN+)
NetR?#33_1: R?#33.1 R?#34.2 U?#19.6(IN-)
NetR?#35_1: R?#35.1 R?#37.1 U?#20.13(IN-)
NetR?#36_2: R?#36.2 U?#19.5(IN+)
NetR?#38_1: R?#38.1 R?#39.2 U?#20.12(IN+)

### Notes on the sheet
- (near U?#18) Salida del sensor de efecto hall sin la tensión de 2.5V.
  Por lo tanto si la salida es 0V, la corriente es 0A. La salida crece con valores de corriente del electroimán positivos
- Etapa para quitarle 2.5V a la referencia de posición del potenciómetro.
  Revisar tema de resistencias para no cargar la etapa del restador en el compensador analógico
- Levitador magnético
- Microcontrolador
- Ignacio Islas
- Javier Mosconi
- Juan Manuel Guariste
- 1.0

### Library data of the parts
50k R?#31-R?#39 = Resistencia: as R?#25 on sheet Estimador; Published: 8-Jun-2000; Revision: July-2002: Re-released for DXP Platform.; Publisher: Altium Limited
C?#13 C?#14 = Capacitor: as C?#9 on sheet Estimador; Published: 08/06/2000; Publisher: Altium Hobart Technology Centre; SubClass: Capacitor
U?#17-U?#20 = MCP664: Datasheet: https://ar.mouser.com/datasheet/2/268/22194B-77503.pdf

## Sheet uC.SchDoc
size A4
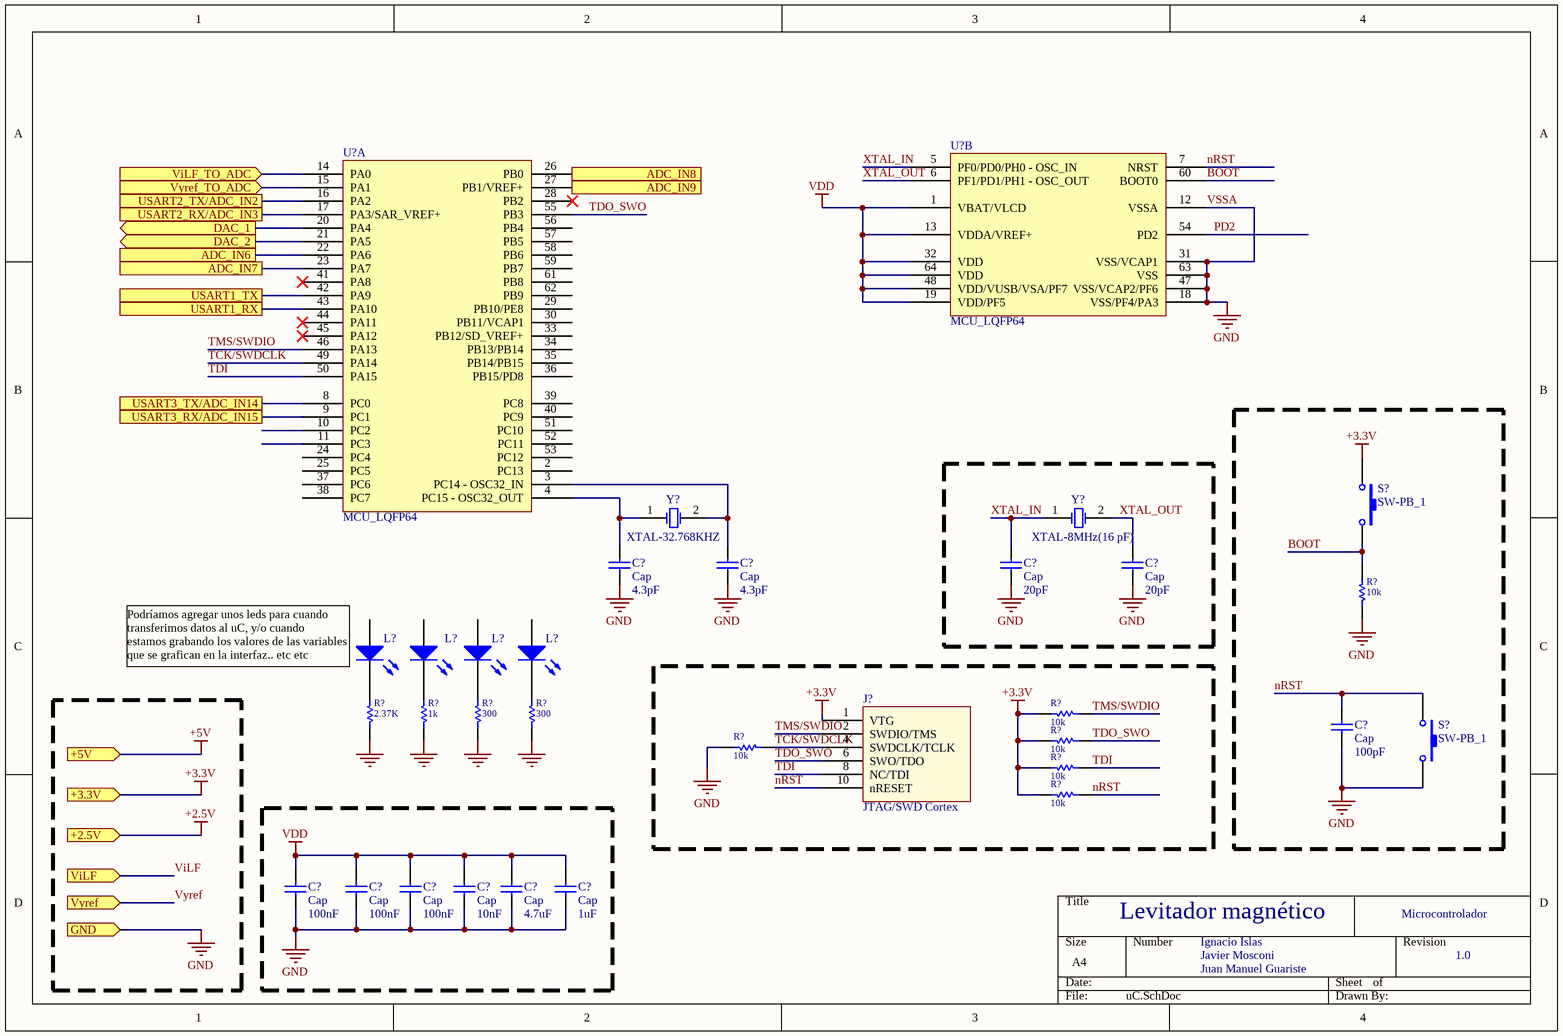
[diagram p6: uC.SchDoc]

### Parts
(Parts that share a designator on the sheet are numbered #1, #2 ... from top to bottom, then left to right.)
C?#15  Cap  value 4.3pF  [RAD-0.3]
C?#16  Cap  value 4.3pF  [RAD-0.3]
C?#17  Cap  value 20pF  [RAD-0.3]
C?#18  Cap  value 20pF  [RAD-0.3]
C?#19  Cap  value 100pF  [RAD-0.3]
C?#20  Cap  value 100nF  [RAD-0.3]
C?#21  Cap  value 100nF  [RAD-0.3]
C?#22  Cap  value 100nF  [RAD-0.3]
C?#23  Cap  value 10nF  [RAD-0.3]
C?#24  Cap  value 4.7uF  [RAD-0.3]
C?#25  Cap  value 1uF  [RAD-0.3]
J?  JTAG/SWD Cortex  [_HDR2X5]
L?#1  LED1  [LED 1206 RED]  (value not drawn)
L?#2  LED1  [LED 1206 RED]  (value not drawn)
L?#3  LED1  [LED 1206 RED]  (value not drawn)
L?#4  LED1  [LED 1206 RED]  (value not drawn)
R?#40  10k  [R1206]
R?#41  2.37K  [R1206]
R?#42  1k  [R1206]
R?#43  300  [R1206]
R?#44  300  [R1206]
R?#45  10k  [R1206]
R?#46  10k  [R1206]
R?#47  10k  [R1206]
R?#48  10k  [R1206]
R?#49  10k  [R1206]
S?#1  SW-PB_1  [SPST-NO SMD]
S?#2  SW-PB_1  [SPST-NO SMD]
U?#21  MCU_LQFP64  [LQFP64_M]  (part B of 2)
U?#22  MCU_LQFP64  [LQFP64_M]  (part A of 2)
Y?#1  XTAL-32.768KHZ  [R38]
Y?#2  XTAL-8MHz(16 pF)  [R38]

### Ports
+2.5V (in), +3.3V (in), +5V (in), ADC_IN6, ADC_IN7, ADC_IN8, ADC_IN9, DAC_1 (out), DAC_2 (out), GND (in), USART1_RX, USART1_TX, USART2_RX/ADC_IN3, USART2_TX/ADC_IN2, USART3_RX/ADC_IN15, USART3_TX/ADC_IN14, ViLF (in), ViLF_TO_ADC (in), Vyref (in), Vyref_TO_ADC (in)

### Nets
+3.3V: J?.1(VTG) R?#45.2 R?#46.2 R?#48.2 R?#49.2 S?#1.1 ; port +3.3V
VDD: C?#20.1 C?#21.1 C?#22.1 C?#23.1 C?#24.1 C?#25.1 U?#21.1(VBAT/VLCD) U?#21.13(VDDA/VREF+) U?#21.19(VDD/PF5) U?#21.32(VDD) U?#21.48(VDD/VUSB/VSA/PF7) U?#21.64(VDD)
VSSA: C?#15.2 C?#16.2 C?#17.2 C?#18.2 C?#19.2 C?#20.2 C?#21.2 C?#22.2 C?#23.2 C?#24.2 C?#25.2 J?.3(GND) J?.5(GND) J?.9(GND) R?#40.2 R?#41.1 R?#42.2 R?#43.1 R?#44.1 R?#47.2 S?#2.2 U?#21.12(VSSA) U?#21.18(VSS/PF4/PA3) U?#21.31(VSS/VCAP1) U?#21.47(VSS/VCAP2/PF6) U?#21.63(VSS) ; port GND  [also labelled GND]
BOOT: R?#40.1 S?#1.2 U?#21.60(BOOT0)
nRST: C?#19.1 J?.10(nRESET) R?#49.1 S?#2.1 U?#21.7(NRST)
PD2: U?#21.54(PD2)
TCK/SWDCLK: J?.4(SWDCLK/TCLK) R?#47.1 U?#22.49(PA14)
TDI: J?.8(NC/TDI) R?#48.1 U?#22.50(PA15)
TDO_SWO: J?.6(SWO/TDO) R?#46.1 U?#22.55(PB3)
TMS/SWDIO: J?.2(SWDIO/TMS) R?#45.1 U?#22.46(PA13)
ViLF: port ViLF
ViLF_TO_ADC: U?#22.14(PA0) ; port ViLF_TO_ADC
ViLR_DAC: U?#22.20(PA4) ; port DAC_1
VyF_DAC: U?#22.21(PA5) ; port DAC_2
Vyref: port Vyref
Vyref_TO_ADC: U?#22.15(PA1) ; port Vyref_TO_ADC
XTAL_IN: C?#17.1 U?#21.5(PF0/PD0/PH0_-_OSC_IN) Y?#2.1(OSC1)
XTAL_OUT: C?#18.1 U?#21.6(PF1/PD1/PH1_-_OSC_OUT) Y?#2.2(OSC2)
NetC?#15_1: C?#15.1 U?#22.4(PC15_-_OSC32_OUT) Y?#1.1(OSC1)
NetC?#16_1: C?#16.1 U?#22.3(PC14_-_OSC32_IN) Y?#1.2(OSC2)
NetL?#1_2: L?#1.2(K) R?#41.2
NetL?#2_2: L?#2.2(K) R?#42.1
NetL?#3_2: L?#3.2(K) R?#43.2
NetL?#4_2: L?#4.2(K) R?#44.2
NetU?#22_8: U?#22.8(PC0) ; port USART3_TX/ADC_IN14
NetU?#22_9: U?#22.9(PC1) ; port USART3_RX/ADC_IN15
NetU?#22_16: U?#22.16(PA2) ; port USART2_TX/ADC_IN2
NetU?#22_17: U?#22.17(PA3/SAR_VREF+) ; port USART2_RX/ADC_IN3
NetU?#22_22: U?#22.22(PA6) ; port ADC_IN6
NetU?#22_23: U?#22.23(PA7) ; port ADC_IN7
NetU?#22_26: U?#22.26(PB0) ; port ADC_IN8
NetU?#22_27: U?#22.27(PB1/VREF+) ; port ADC_IN9
NetU?#22_42: U?#22.42(PA9) ; port USART1_TX
NetU?#22_43: U?#22.43(PA10) ; port USART1_RX

Not connected (* = marked no-connect by the designer): J? 7(NC); L?#1 1(A); L?#2 1(A); L?#3 1(A); L?#4 1(A); U?#22 2(PC13) 10(PC2) 11(PC3) 24(PC4) 25(PC5) 28(PB2)* 29(PB10/PE8) 30(PB11/VCAP1) 33(PB12/SD_VREF+) 34(PB13/PB14) 35(PB14/PB15) 36(PB15/PD8) 37(PC6) 38(PC7) 39(PC8) 40(PC9) 41(PA8)* 44(PA11)* 45(PA12)* 51(PC10) 52(PC11) 53(PC12) 56(PB4) 57(PB5) 58(PB6) 59(PB7) 61(PB8) 62(PB9)

### Notes on the sheet
- (near L?#1) Podríamos agregar unos leds para cuando transferimos datos al uC, y/o cuando
  estamos grabando los valores de las variables que se grafican en la interfaz.. etc etc
- Levitador magnético
- Microcontrolador
- Ignacio Islas
- Javier Mosconi
- Juan Manuel Guariste
- 1.0

### Library data of the parts
C?#15-C?#25 = Cap: Capacitor; Published: 8-Jun-2000; LatestRevisionDate: 17-Jul-2002; LatestRevisionNote: Re-released for DXP Platform.; PackageReference: RAD-0.3; Publisher: Altium Limited; PackageDescription: Radial Cap, Thru-Hole; 2 Leads; 0.3 in Pin Spacing
L?#1-L?#4 = LED1: Typical RED GaAs LED; Published: 8-Jun-2000; LatestRevisionDate: 08-Jul-2005; LatestRevisionNote: Mech Layer 1 removed.; PackageReference: LED-1; Publisher: Altium Limited
R?#40-R?#49 = R1206: Resistor Chip; 1/8W;; Published: 8-Jun-2000; LatestRevisionDate: 26/8/2013; PackageReference: 1206; Publisher: Altium Limited; PackageDescription: SMT Chip Resistor; Supplier 1: Digi-Key
  R?#40 R?#45-R?#49: Value: 10k
  R?#41: Value: 2.37K
  R?#42: Value: 1k
  R?#43 R?#44: Value: 300
S?#1 S?#2 = SW-PB_1: Switch; Published: 24-Mar-1999; LatestRevisionDate: 17-Jul-2002; LatestRevisionNote: Re-released for DXP Platform.; PackageReference: SPST-2; Publisher: Altium Limited; PackageDescription: Switch; 2 Leads
U?#21 U?#22 = MCU_LQFP64: STM32F072RB
Y?#1 Y?#2 = XTAL: Crystal Oscillator; Published: 8-Jun-2000; LatestRevisionDate: 17-Jul-2002; LatestRevisionNote: Re-released for DXP Platform.; PackageReference: R38; Publisher: Altium Limited; PackageDescription: Crystal, Thru-Hole; 2 Leads; Body 3.1 x 8.2 mm (Dia.xH)

## Sheet PlacaDeMedicion.SchDoc
size A4
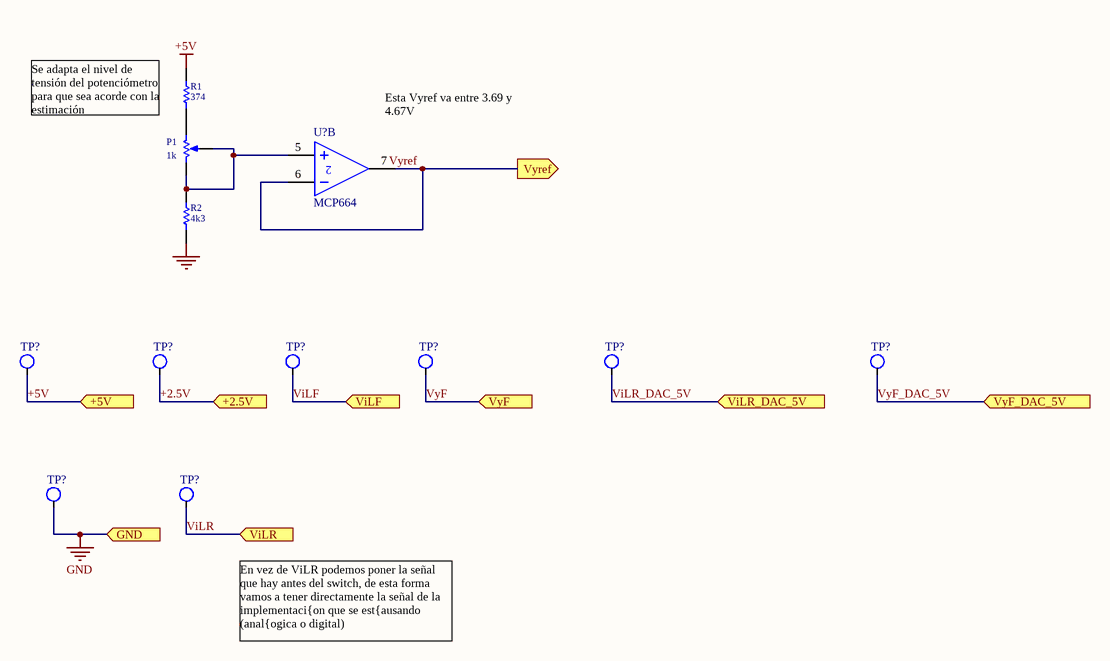
[diagram p7: PlacaDeMedicion.SchDoc]

### Parts
(Parts that share a designator on the sheet are numbered #1, #2 ... from top to bottom, then left to right.)
P1  value 1k  [BOR3]  (hidden comment: RPot)
R1  374  [R1206]
R2  4k3  [R1206]
TP?#5  Vyr  [TestPoint Keystone 5000 Silver-Red]  (value not drawn)
TP?#6  Vyr  [TestPoint Keystone 5000 Silver-Red]  (value not drawn)
TP?#7  Vyr  [TestPoint Keystone 5000 Silver-Red]  (value not drawn)
TP?#8  Vyr  [TestPoint Keystone 5000 Silver-Red]  (value not drawn)
TP?#9  Vyr  [TestPoint Keystone 5000 Silver-Red]  (value not drawn)
TP?#10  Vyr  [TestPoint Keystone 5000 Silver-Red]  (value not drawn)
TP?#11  Vyr  [TestPoint Keystone 5000 Silver-Red]  (value not drawn)
TP?#12  Vyr  [TestPoint Keystone 5000 Silver-Red]  (value not drawn)
U?#23  MCP664  [SOIC14]  (part B of 4)

### Ports
+2.5V (in), +5V (in), GND (in), ViLF (in), ViLR (in), ViLR_DAC_5V (in), VyF (in), VyF_DAC_5V (in), Vyref (out)

### Nets
+2.5V: TP?#6.1 ; port +2.5V
+5V: R1.2 TP?#5.1 ; port +5V
GND: R2.1 TP?#11.1 ; port GND  [project net VSSA]
NetLabel66: U?#23.6(IN-) U?#23.7(OUT) ; port Vyref
ViLF: TP?#7.1 ; port ViLF
ViLR: TP?#12.1 ; port ViLR
ViLR_DAC_5V: TP?#9.1 ; port ViLR_DAC_5V
VyF: TP?#8.1 ; port VyF
VyF_DAC_5V: TP?#10.1 ; port VyF_DAC_5V
NetP1_1: P1.1(TOP) R1.1
NetP1_2: P1.2(TAP) P1.3(BOT) R2.2 U?#23.5(IN+)

### Notes on the sheet
- Se adapta el nivel de tensión del potenciómetro para que sea acorde con la estimación
- (near U?#23) Esta Vyref va entre 3.69 y 4.67V
- En vez de ViLR podemos poner la señal que hay antes del switch, de esta forma vamos a tener directamente la señal de la implementaci{on que se est{ausando (anal{ogica o digital)
- Labels drawn without touching a wire or pin: Vyref

### Library data of the parts
P1 = RPot: Potentiometer; Sim Note: Enter the Resistance value and the set point into parameter fields.; Set Position: 0.5; Published: 8-Jun-2000; LatestRevisionDate: 17-Jul-2002; LatestRevisionNote: Re-released for DXP Platform.; PackageReference: VR5; Publisher: Altium Limited
R1 R2 = R1206: Resistor Chip; 1/8W;; Published: 8-Jun-2000; LatestRevisionDate: 26/8/2013; PackageReference: 1206; Publisher: Altium Limited; PackageDescription: SMT Chip Resistor; Supplier 1: Digi-Key
  R1: Value: 374
  R2: Value: 4k3
TP?#5-TP?#12 = Tespoint: Test point; Link: https://www.digikey.com/en/products/detail/keystone-electronics/5000/255326
U?#23 = MCP664: Datasheet: https://ar.mouser.com/datasheet/2/268/22194B-77503.pdf

## Nets that join several sheets
+2.5V: Controlador de corriente  V3 (5 pins), Fuentes (C400.2 VR400.5 VR400.6), Compensador (6 pins), Estimador (R63.2 U?#15.12 U?#16.5), Signals2uC (R?#37.2), PlacaDeMedicion (TP?#6.1)
+3.3V: Fuentes (C?#3.1 D401#1.1 L4.1 U?#5.4), Signals2uC (C?#13.2 C?#14.1 U?#17.4 U?#18.4), uC (6 pins)
+5V: Controlador de corriente  V3 (6 pins), Fuentes (11 pins), Compensador (C?#5.2 C?#7.1 U?#8.4 U?#10.4), Estimador (R59.1 U?#13.4 U?#14.4), PlacaDeMedicion (R1.2 TP?#5.1)
+12V: Controlador de corriente  V3 (9 pins), Fuentes (9 pins)
+24V: Controlador de corriente  V3 (8 pins), Fuentes (F400.1 J400.1 L1.1)
VSSA: Controlador de corriente  V3 (39 pins), Fuentes (21 pins), Compensador (8 pins), Estimador (5 pins), Signals2uC (7 pins), uC (26 pins), PlacaDeMedicion (R2.1 TP?#11.1)
ViLF: Controlador de corriente  V3 (R107.1 R112.2 TP102.1 U?#4.14), Estimador (R?#26.1 R?#30.1), Signals2uC (U?#18.3), PlacaDeMedicion (TP?#7.1)
ViLF_TO_ADC: Signals2uC (U?#18.1 U?#18.2), uC (U?#22.14)
ViLR: Controlador de corriente  V3 (P100#1.2), Compensador (R?#24.2 U?#11.7), PlacaDeMedicion (TP?#12.1)
ViLR_DAC: Signals2uC (R?#32.1), uC (U?#22.20)
ViLR_DAC_5V: Signals2uC (50k.2 U?#17.1), PlacaDeMedicion (TP?#9.1)
VyF: Compensador (R?#4.1 R?#5.1), Estimador (C26.1 R56.1 TP?#3.1 U?#13.1), PlacaDeMedicion (TP?#8.1)
VyF_DAC: Signals2uC (R?#36.1), uC (U?#22.21)
VyF_DAC_5V: Signals2uC (R?#33.2 U?#19.7), PlacaDeMedicion (TP?#10.1)
Vyref: Compensador (R?#9.1), Signals2uC (R?#38.2)
Vyref_TO_ADC: Signals2uC (R?#35.2 U?#20.14), uC (U?#22.15)